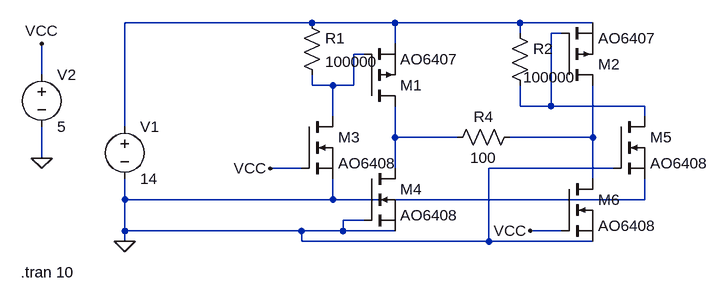
[diagram p0: schematic P-MOSFET_MotorDrive.asc]
P-MOSFET_MotorDrive.asc, the LTspice schematic file:
Version 4
SHEET 1 888 680
WIRE 64 48 -224 48
WIRE 192 48 64 48
WIRE 384 48 192 48
WIRE 496 48 384 48
WIRE 384 64 384 48
WIRE 448 64 432 64
WIRE 192 80 192 48
WIRE 144 96 128 96
WIRE -352 128 -352 80
WIRE 64 144 64 128
WIRE 96 144 64 144
WIRE 128 144 128 96
WIRE 128 144 96 144
WIRE 384 176 384 144
WIRE 432 176 432 64
WIRE 432 176 384 176
WIRE 576 176 432 176
WIRE 96 192 96 144
WIRE 576 192 576 176
WIRE -224 208 -224 48
WIRE 192 224 192 176
WIRE 288 224 192 224
WIRE 496 224 496 144
WIRE 496 224 368 224
WIRE -352 256 -352 208
WIRE 48 272 0 272
WIRE 192 272 192 224
WIRE 528 272 336 272
WIRE 496 288 496 224
WIRE -224 320 -224 288
WIRE 96 320 96 288
WIRE 96 320 -224 320
WIRE 576 320 576 288
WIRE 576 320 96 320
WIRE 144 352 112 352
WIRE -224 368 -224 320
WIRE 48 368 -224 368
WIRE 112 368 112 352
WIRE 112 368 48 368
WIRE 192 368 112 368
WIRE 448 368 400 368
WIRE -224 384 -224 368
WIRE 48 384 48 368
WIRE 336 384 336 272
WIRE 336 384 48 384
WIRE 496 384 336 384
FLAG -224 384 0
FLAG -352 256 0
FLAG -352 80 VCC
FLAG 0 272 VCC
FLAG 400 368 VCC
SYMBOL pmos 144 176 M180
SYMATTR InstName M1
SYMATTR Value AO6407
SYMBOL pmos 448 144 M180
SYMATTR InstName M2
SYMATTR Value AO6407
SYMBOL nmos 48 192 R0
SYMATTR InstName M3
SYMATTR Value AO6408
SYMBOL nmos 144 272 R0
SYMATTR InstName M4
SYMATTR Value AO6408
SYMBOL nmos 528 192 R0
SYMATTR InstName M5
SYMATTR Value AO6408
SYMBOL nmos 448 288 R0
SYMATTR InstName M6
SYMATTR Value AO6408
SYMBOL voltage -224 192 R0
WINDOW 123 0 0 Left 0
WINDOW 39 0 0 Left 0
SYMATTR InstName V1
SYMATTR Value 14
SYMBOL voltage -352 112 R0
WINDOW 123 0 0 Left 0
WINDOW 39 0 0 Left 0
SYMATTR InstName V2
SYMATTR Value 5
SYMBOL res 48 32 R0
SYMATTR InstName R1
SYMATTR Value 100000
SYMBOL res 368 48 R0
WINDOW 3 21 84 Left 2
SYMATTR InstName R2
SYMATTR Value 100000
SYMBOL res 384 208 R90
WINDOW 0 0 56 VBottom 2
WINDOW 3 32 56 VTop 2
SYMATTR InstName R4
SYMATTR Value 100
TEXT -384 432 Left 2 !.tran 10

The netlist it stands for:
* P-MOSFET_MotorDrive.asc
M1 N004 N003 N001 N001 AO6407
M2 N005 N002 N001 N001 AO6407
M3 N003 VCC 0 0 AO6408
M4 N004 0 0 0 AO6408
M5 N002 0 0 0 AO6408
M6 N005 VCC 0 0 AO6408
V1 N001 0 14
V2 VCC 0 5
R1 N001 N003 100000
R2 N001 N002 100000
R4 N005 N004 100
.model NMOS NMOS
.model PMOS PMOS
.lib standard.mos
.tran 10
.backanno
.end